# EAGLE design NumPad (EAGLE 6.3)
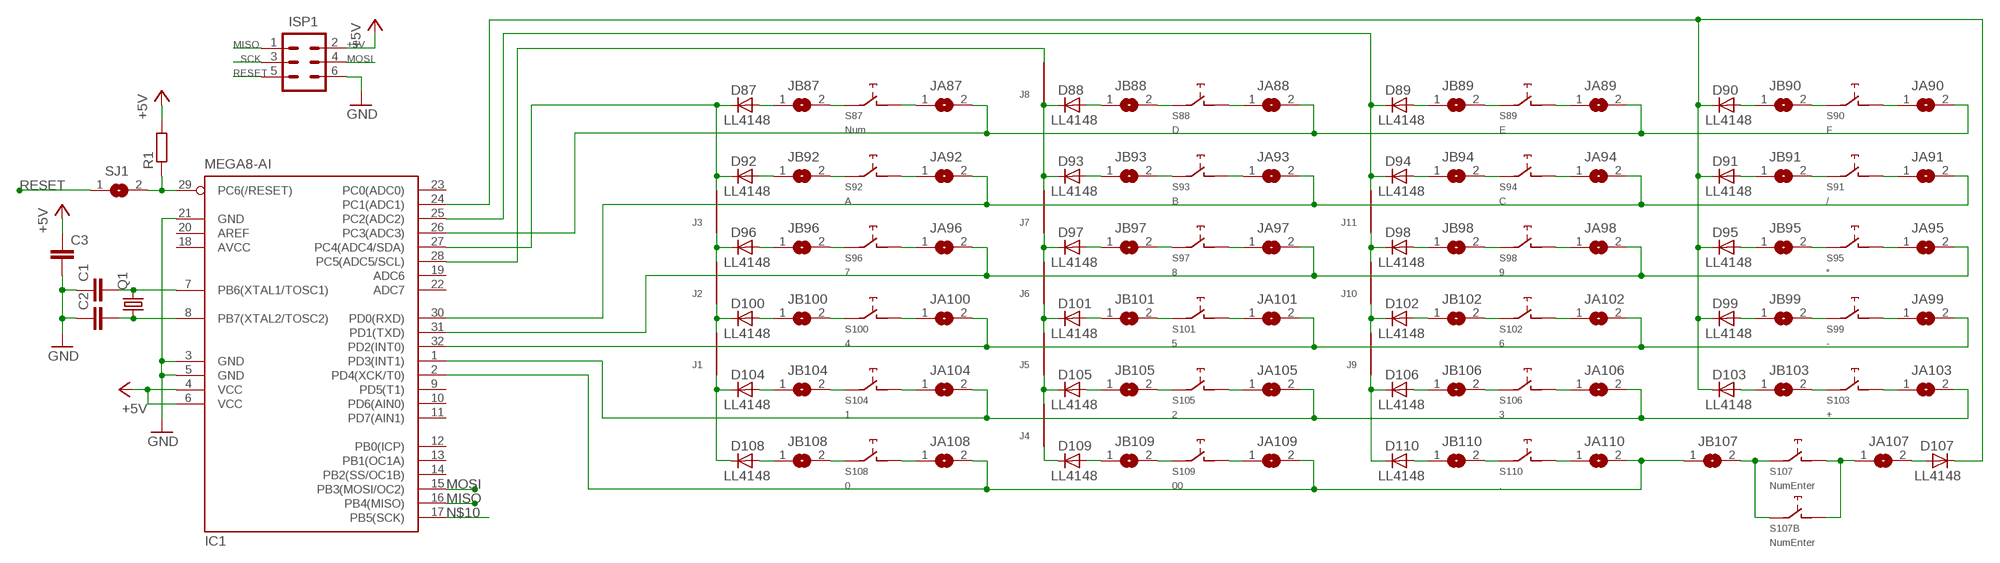
[diagram p0: schematic, sheet 1]

## Parts
C1  C-EUC0805  [C0805]
C2  C-EUC0805  [C0805]
C3  C-EUC0805  [C0805]
D87  LL4148  [SOD80C]
D88  LL4148  [SOD80C]
D89  LL4148  [SOD80C]
D90  LL4148  [SOD80C]
D91  LL4148  [SOD80C]
D92  LL4148  [SOD80C]
D93  LL4148  [SOD80C]
D94  LL4148  [SOD80C]
D95  LL4148  [SOD80C]
D96  LL4148  [SOD80C]
D97  LL4148  [SOD80C]
D98  LL4148  [SOD80C]
D99  LL4148  [SOD80C]
D100  LL4148  [SOD80C]
D101  LL4148  [SOD80C]
D102  LL4148  [SOD80C]
D103  LL4148  [SOD80C]
D104  LL4148  [SOD80C]
D105  LL4148  [SOD80C]
D106  LL4148  [SOD80C]
D107  LL4148  [SOD80C]
D108  LL4148  [SOD80C]
D109  LL4148  [SOD80C]
D110  LL4148  [SOD80C]
IC1  MEGA8-AI  [TQFP32-08]
ISP1  MA03-2  [MA03-2]
J1  J  [R1206W]
J2  J  [R1206W]
J3  J  [R1206W]
J4  J  [R1206W]
J5  J  [R1206W]
J6  J  [R1206W]
J7  J  [R1206W]
J8  J  [R1206W]
J9  J  [R1206W]
J10  J  [R1206W]
J11  J  [R1206W]
JA87  SJ  [SJ]
JA88  SJ  [SJ]
JA89  SJ  [SJ]
JA90  SJ  [SJ]
JA91  SJ  [SJ]
JA92  SJ  [SJ]
JA93  SJ  [SJ]
JA94  SJ  [SJ]
JA95  SJ  [SJ]
JA96  SJ  [SJ]
JA97  SJ  [SJ]
JA98  SJ  [SJ]
JA99  SJ  [SJ]
JA100  SJ  [SJ]
JA101  SJ  [SJ]
JA102  SJ  [SJ]
JA103  SJ  [SJ]
JA104  SJ  [SJ]
JA105  SJ  [SJ]
JA106  SJ  [SJ]
JA107  SJ  [SJ]
JA108  SJ  [SJ]
JA109  SJ  [SJ]
JA110  SJ  [SJ]
JB87  SJ  [SJ]
JB88  SJ  [SJ]
JB89  SJ  [SJ]
JB90  SJ  [SJ]
JB91  SJ  [SJ]
JB92  SJ  [SJ]
JB93  SJ  [SJ]
JB94  SJ  [SJ]
JB95  SJ  [SJ]
JB96  SJ  [SJ]
JB97  SJ  [SJ]
JB98  SJ  [SJ]
JB99  SJ  [SJ]
JB100  SJ  [SJ]
JB101  SJ  [SJ]
JB102  SJ  [SJ]
JB103  SJ  [SJ]
JB104  SJ  [SJ]
JB105  SJ  [SJ]
JB106  SJ  [SJ]
JB107  SJ  [SJ]
JB108  SJ  [SJ]
JB109  SJ  [SJ]
JB110  SJ  [SJ]
Q1  CRYSTALHC49S  [HC49/S]
R1  R-EU_R0805  [R0805]
S87  Num  CHERRY-MX-4P  [CHERRY-MX-4P]
S88  D  CHERRY-MX-4P  [CHERRY-MX-4P]
S89  E  CHERRY-MX-4P  [CHERRY-MX-4P]
S90  F  CHERRY-MX-4P  [CHERRY-MX-4P]
S91  /  CHERRY-MX-4P  [CHERRY-MX-4P]
S92  A  CHERRY-MX-4P  [CHERRY-MX-4P]
S93  B  CHERRY-MX-4P  [CHERRY-MX-4P]
S94  C  CHERRY-MX-4P  [CHERRY-MX-4P]
S95  *  CHERRY-MX-4P  [CHERRY-MX-4P]
S96  7  CHERRY-MX-4P  [CHERRY-MX-4P]
S97  8  CHERRY-MX-4P  [CHERRY-MX-4P]
S98  9  CHERRY-MX-4P  [CHERRY-MX-4P]
S99  -  CHERRY-MX-4P  [CHERRY-MX-4P]
S100  4  CHERRY-MX-4P  [CHERRY-MX-4P]
S101  5  CHERRY-MX-4P  [CHERRY-MX-4P]
S102  6  CHERRY-MX-4P  [CHERRY-MX-4P]
S103  +  CHERRY-MX-4P  [CHERRY-MX-4P]
S104  1  CHERRY-MX-4P  [CHERRY-MX-4P]
S105  2  CHERRY-MX-4P  [CHERRY-MX-4P]
S106  3  CHERRY-MX-4P  [CHERRY-MX-4P]
S107  NumEnter  CHERRY-MX-4P  [CHERRY-MX-4P]
S107B  NumEnter  CHERRY-MX  [CHERRY-MX]
S108  0  CHERRY-MX-4P  [CHERRY-MX-4P]
S109  00  CHERRY-MX-4P  [CHERRY-MX-4P]
S110  .  CHERRY-MX-4P  [CHERRY-MX-4P]
SJ1  SJ  [SJ]

## Nets
+5V: C3.1 IC1.4(VCC) IC1.6(VCC) ISP1.2 R1.2
GND: C1.1 C2.1 C3.2 IC1.3(GND) IC1.5(GND) IC1.21(GND) ISP1.6
MISO: IC1.16(PB4(MISO)) ISP1.1
MOSI: IC1.15(PB3(MOSI/OC2)) ISP1.4
N$1: IC1.2(PD4(XCK/T0)) JA108.2 JA109.2 JA110.2 JB107.1
N$2: D107.A JA107.2
N$3: IC1.1(PD3(INT1)) JA103.2 JA104.2 JA105.2 JA106.2
N$4: IC1.32(PD2(INT0)) JA99.2 JA100.2 JA101.2 JA102.2
N$5: IC1.31(PD1(TXD)) JA95.2 JA96.2 JA97.2 JA98.2
N$6: IC1.30(PD0(RXD)) JA91.2 JA92.2 JA93.2 JA94.2
N$7: IC1.26(PC3(ADC3)) JA87.2 JA88.2 JA89.2 JA90.2
N$8: D100.C J1.1 J2.2
N$9: IC1.29(PC6(/RESET)) R1.1 SJ1.2
N$10: IC1.17(PB5(SCK))
N$12: D104.C D108.C J1.2
N$13: D87.C D92.C IC1.27(PC4(ADC4/SDA)) J3.1
N$14: IC1.28(PC5(ADC5/SCL)) J8.1
N$15: D96.C J2.1 J3.2
N$16: D89.C D94.C IC1.25(PC2(ADC2)) J11.1
N$17: D109.C J4.2
N$18: D105.C J4.1 J5.2
N$19: D101.C J5.1 J6.2
N$20: D97.C J6.1 J7.2
N$21: D88.C D93.C J7.1 J8.2
N$22: D102.C J9.1 J10.2
N$23: D106.C D110.C J9.2
N$24: D98.C J10.1 J11.2
N$51: JA107.1 S107.SW2(PIN-2) S107B.SW2(PIN-2)
N$60: D104.A JB104.1
N$268: D87.A JB87.1
N$269: D88.A JB88.1
N$270: JB87.2 S87.SW1(PIN-1)
N$271: JB88.2 S88.SW1(PIN-1)
N$272: JA87.1 S87.SW2(PIN-2)
N$273: JA88.1 S88.SW2(PIN-2)
N$274: D89.A JB89.1
N$275: JB89.2 S89.SW1(PIN-1)
N$276: JA89.1 S89.SW2(PIN-2)
N$277: D90.A JB90.1
N$278: JB90.2 S90.SW1(PIN-1)
N$279: JA90.1 S90.SW2(PIN-2)
N$280: D91.A JB91.1
N$281: JB91.2 S91.SW1(PIN-1)
N$282: JA91.1 S91.SW2(PIN-2)
N$283: JB92.2 S92.SW1(PIN-1)
N$284: D92.A JB92.1
N$285: JA92.1 S92.SW2(PIN-2)
N$286: JA93.1 S93.SW2(PIN-2)
N$287: JB93.2 S93.SW1(PIN-1)
N$288: D93.A JB93.1
N$289: D94.A JB94.1
N$290: JB94.2 S94.SW1(PIN-1)
N$291: JA94.1 S94.SW2(PIN-2)
N$292: D95.A JB95.1
N$293: JB95.2 S95.SW1(PIN-1)
N$294: JA95.1 S95.SW2(PIN-2)
N$295: D96.A JB96.1
N$296: JB96.2 S96.SW1(PIN-1)
N$297: JA96.1 S96.SW2(PIN-2)
N$298: JB97.2 S97.SW1(PIN-1)
N$299: JA97.1 S97.SW2(PIN-2)
N$300: D97.A JB97.1
N$301: D98.A JB98.1
N$302: JB98.2 S98.SW1(PIN-1)
N$303: JA98.1 S98.SW2(PIN-2)
N$304: D99.A JB99.1
N$305: JB99.2 S99.SW1(PIN-1)
N$306: JA99.1 S99.SW2(PIN-2)
N$307: D100.A JB100.1
N$308: JB100.2 S100.SW1(PIN-1)
N$309: JA100.1 S100.SW2(PIN-2)
N$310: JB101.2 S101.SW1(PIN-1)
N$311: D101.A JB101.1
N$312: JA101.1 S101.SW2(PIN-2)
N$313: D102.A JB102.1
N$314: JB102.2 S102.SW1(PIN-1)
N$315: JA102.1 S102.SW2(PIN-2)
N$316: D103.A JB103.1
N$317: JB103.2 S103.SW1(PIN-1)
N$318: JA103.1 S103.SW2(PIN-2)
N$319: JB107.2 S107.SW1(PIN-1) S107B.SW1(PIN-1)
N$320: JB104.2 S104.SW1(PIN-1)
N$321: JA104.1 S104.SW2(PIN-2)
N$322: JB105.2 S105.SW1(PIN-1)
N$323: D105.A JB105.1
N$324: JA105.1 S105.SW2(PIN-2)
N$325: D106.A JB106.1
N$326: JB106.2 S106.SW1(PIN-1)
N$327: JA106.1 S106.SW2(PIN-2)
N$329: JB108.2 S108.SW1(PIN-1)
N$330: JA108.1 S108.SW2(PIN-2)
N$331: D108.A JB108.1
N$332: JB109.2 S109.SW1(PIN-1)
N$333: D109.A JB109.1
N$334: JA109.1 S109.SW2(PIN-2)
N$335: D110.A JB110.1
N$336: JB110.2 S110.SW1(PIN-1)
N$337: JA110.1 S110.SW2(PIN-2)
N$338: C1.2 IC1.7(PB6(XTAL1/TOSC1)) Q1.2
N$339: C2.2 IC1.8(PB7(XTAL2/TOSC2)) Q1.1
RESET: ISP1.5 SJ1.1
SCK: D90.C D91.C D95.C D99.C D103.C D107.C IC1.24(PC1(ADC1)) ISP1.3
Unconnected: IC1.9(PD5(T1)) IC1.10(PD6(AIN0)) IC1.11(PD7(AIN1)) IC1.12(PB0(ICP)) IC1.13(PB1(OC1A)) IC1.14(PB2(SS/OC1B)) IC1.19(ADC6) IC1.20(AREF) IC1.22(ADC7) IC1.23(PC0(ADC0)) S87.D1(_D:D1) S87.D2(_D:D2) S87.LED1(_L:LED1) S87.LED2(_L:LED2) S88.D1(_D:D1) S88.D2(_D:D2) S88.LED1(_L:LED1) S88.LED2(_L:LED2) S89.D1(_D:D1) S89.D2(_D:D2) S89.LED1(_L:LED1) S89.LED2(_L:LED2) S90.D1(_D:D1) S90.D2(_D:D2) S90.LED1(_L:LED1) S90.LED2(_L:LED2) S91.D1(_D:D1) S91.D2(_D:D2) S91.LED1(_L:LED1) S91.LED2(_L:LED2) S92.D1(_D:D1) S92.D2(_D:D2) S92.LED1(_L:LED1) S92.LED2(_L:LED2) S93.D1(_D:D1) S93.D2(_D:D2) S93.LED1(_L:LED1) S93.LED2(_L:LED2) S94.D1(_D:D1) S94.D2(_D:D2) S94.LED1(_L:LED1) S94.LED2(_L:LED2) S95.D1(_D:D1) S95.D2(_D:D2) S95.LED1(_L:LED1) S95.LED2(_L:LED2) S96.D1(_D:D1) S96.D2(_D:D2) S96.LED1(_L:LED1) S96.LED2(_L:LED2) S97.D1(_D:D1) S97.D2(_D:D2) S97.LED1(_L:LED1) S97.LED2(_L:LED2) S98.D1(_D:D1) S98.D2(_D:D2) S98.LED1(_L:LED1) S98.LED2(_L:LED2) S99.D1(_D:D1) S99.D2(_D:D2) S99.LED1(_L:LED1) S99.LED2(_L:LED2) S100.D1(_D:D1) S100.D2(_D:D2) S100.LED1(_L:LED1) S100.LED2(_L:LED2) S101.D1(_D:D1) S101.D2(_D:D2) S101.LED1(_L:LED1) S101.LED2(_L:LED2) S102.D1(_D:D1) S102.D2(_D:D2) S102.LED1(_L:LED1) S102.LED2(_L:LED2) S103.D1(_D:D1) S103.D2(_D:D2) S103.LED1(_L:LED1) S103.LED2(_L:LED2) S104.D1(_D:D1) S104.D2(_D:D2) S104.LED1(_L:LED1) S104.LED2(_L:LED2) S105.D1(_D:D1) S105.D2(_D:D2) S105.LED1(_L:LED1) S105.LED2(_L:LED2) S106.D1(_D:D1) S106.D2(_D:D2) S106.LED1(_L:LED1) S106.LED2(_L:LED2) S107.D1(_D:D1) S107.D2(_D:D2) S107.LED1(_L:LED1) S107.LED2(_L:LED2) S108.D1(_D:D1) S108.D2(_D:D2) S108.LED1(_L:LED1) S108.LED2(_L:LED2) S109.D1(_D:D1) S109.D2(_D:D2) S109.LED1(_L:LED1) S109.LED2(_L:LED2) S110.D1(_D:D1) S110.D2(_D:D2) S110.LED1(_L:LED1) S110.LED2(_L:LED2)

## Power pins joined to a net without a drawn wire
AVCC: IC1.18(AVCC)

## Library data of the parts
C1-C3 = rcl:C-EU: CAPACITOR, European symbol
D87-D110 = detali:LL4148: DIODE high speed
IC1 = atmel:MEGA8: MICROCONTROLLER 8 Kbytes FLASH, 1 kbytes SRAM, 512 bytes EEPROM, USART, 6-channel 10 bit ADC, 2-channel 8 bit ADC Pin compatible with Atmega48, ATMega88, ATMega168 Source: avr.lbr; MPN: ATMEGA8-16AU; OC_FARNELL: 9171371; OC_NEWARK: 73M8863
ISP1 = con-lstb:MA03-2: PIN HEADER
J1-J11 = detali:J
JA87-JA110 JB87-JB110 SJ1 = detali:SJ: SMD solder JUMPER
Q1 = crystal:CRYSTAL: CRYSTAL; OC_FARNELL: 1667008; OC_NEWARK: unknown
R1 = rcl:R-EU_: RESISTOR, European symbol
S87-S110 = cherrymx:CHERRY-MX-4P
S107B = cherrymx:CHERRY-MX: Cherry MX series keyswitch

## Board
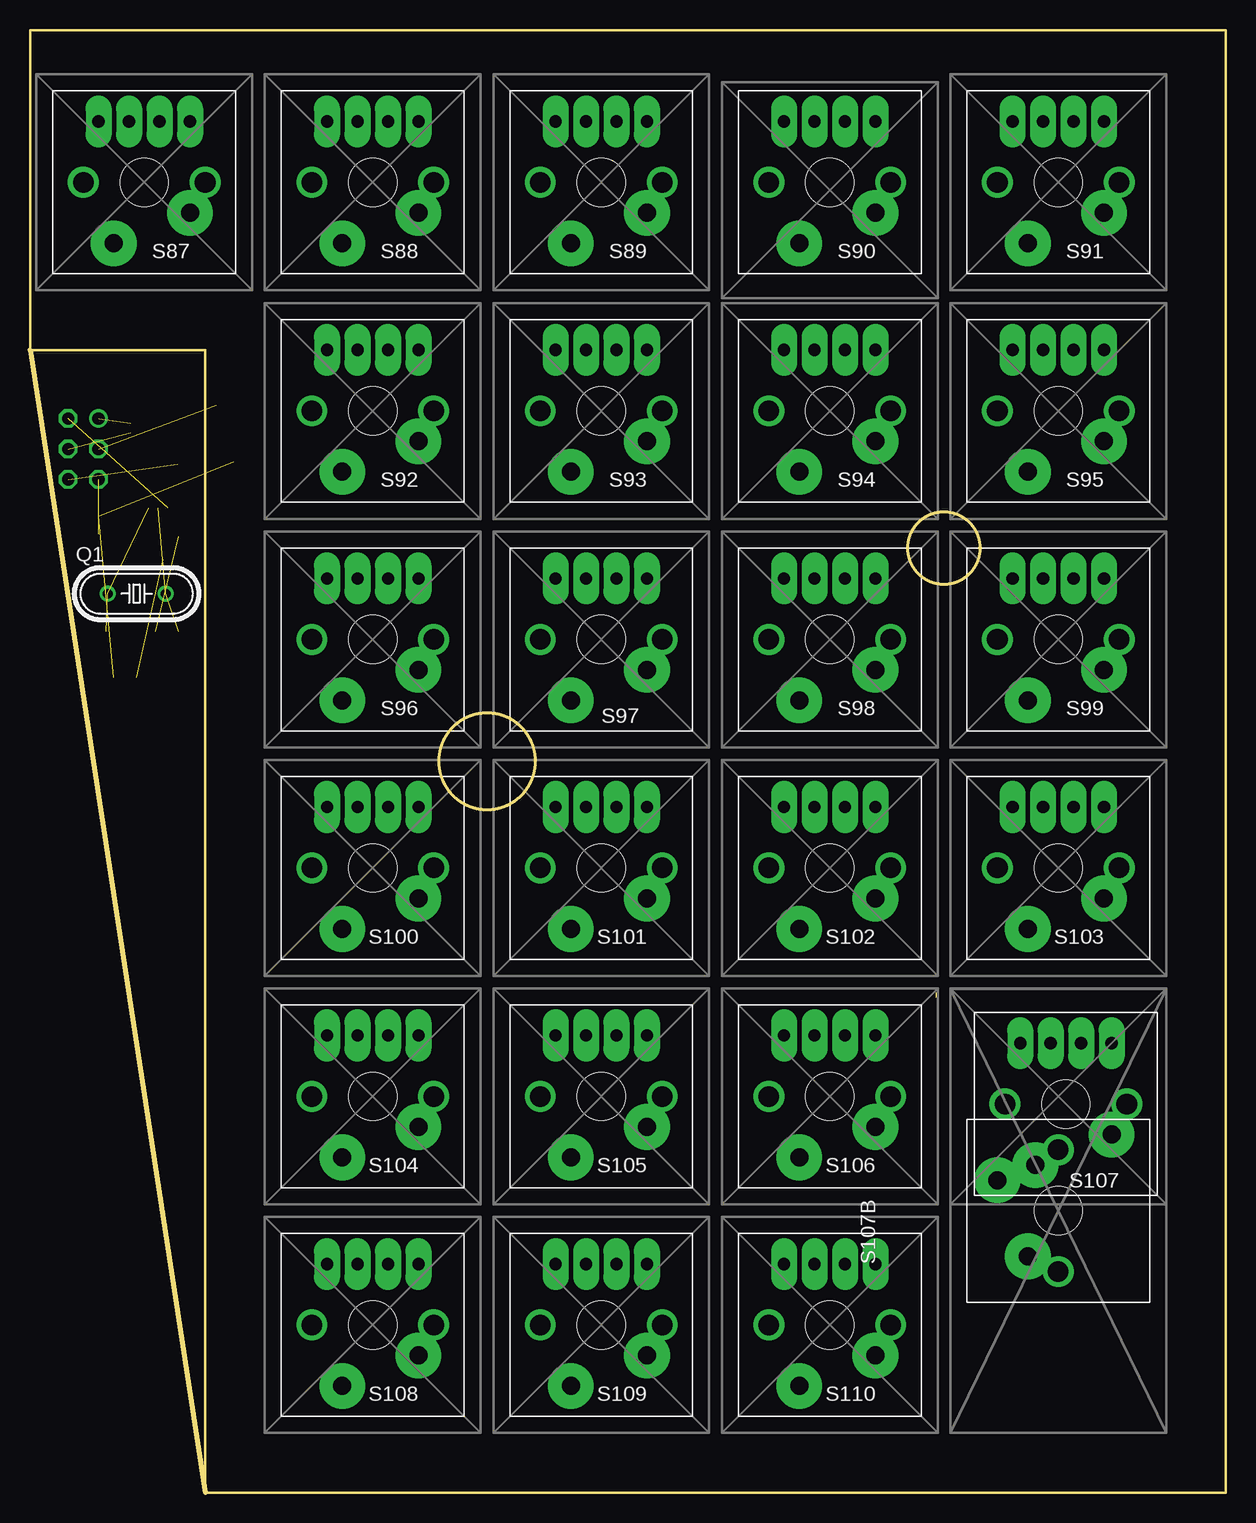
[diagram p1: board, top side]
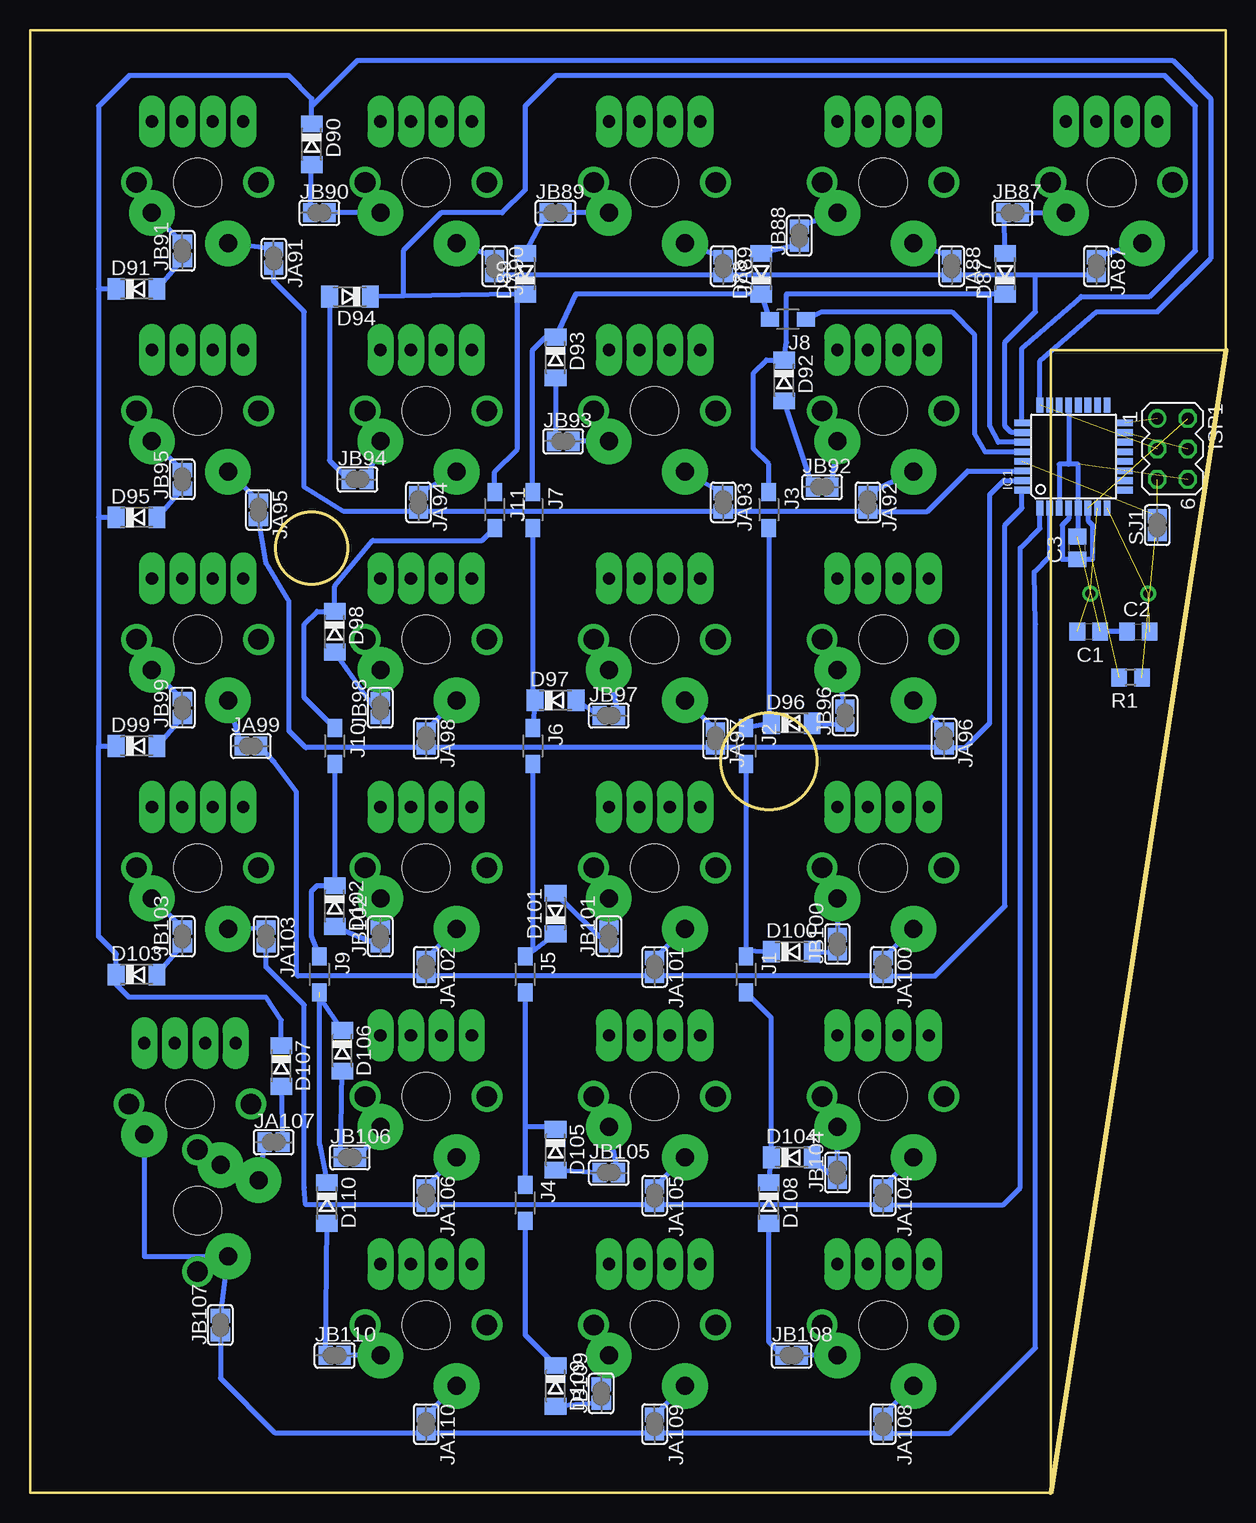
[diagram p2: board, bottom side, seen from below]

Size 99.69 x 121.92 mm. Coordinates in mm from the lower left corner, seen from the top.
Outline: 0,95.25 0,121.92 99.69,121.92 99.69,0 14.61,0
Outline: 0,95.25 14.61,95.25 14.61,0
Outline: 0,95.25 14.61,0
Outline: circle at 38.1,60.96 radius 4
Outline: circle at 76.2,78.74 radius 3
Copper layers (1*16): Top 0.035mm / dielectric 1.5mm / Bottom 0.035mm
Design rules "default": minimum track width 10mil, minimum drill 24mil, track to track 8mil, track to pad 8mil, pad to pad 8mil, via to via 8mil, smd to smd 8mil, copper to edge 40mil, drill to drill 8mil, minimum pad ring 10mil, minimum via ring 8mil, stop-mask expansion 4mil, vias tented up to drill 0mil, thermal gap 10mil

### Footprints (pad centres in the part's own frame; a part is rotated, then mirrored left to right if it is on the bottom)
C0805 = smd 1.3 x 1.5: 1 -0.95,0; 2 0.95,0
SOD80C = smd 1.4 x 1.8 bottom: A -1.7,0; C 1.7,0
TQFP32-08 = smd 1.27 x 0.559: 1 -4.293,2.8; 2 -4.293,2; 3 -4.293,1.2; 4 -4.293,0.4; 5 -4.293,-0.4; 6 -4.293,-1.2; 7 -4.293,-2; 8 -4.293,-2.8; 17 4.293,-2.8; 18 4.293,-2; 19 4.293,-1.2; 20 4.293,-0.4; 21 4.293,0.4; 22 4.293,1.2; 23 4.293,2; 24 4.293,2.8 | smd 0.559 x 1.27: 9 -2.8,-4.293; 10 -2,-4.293; 11 -1.2,-4.293; 12 -0.4,-4.293; 13 0.4,-4.293; 14 1.2,-4.293; 15 2,-4.293; 16 2.8,-4.293; 25 2.8,4.293; 26 2,4.293; 27 1.2,4.293; 28 0.4,4.293; 29 -0.4,4.293; 30 -1.2,4.293; 31 -2,4.293; 32 -2.8,4.293
MA03-2 = drill 1.016: 1 -2.54,-1.27 | drill 1.016 octagon: 2 -2.54,1.27; 3 0,-1.27; 4 0,1.27; 5 2.54,-1.27; 6 2.54,1.27
R1206W = smd 1.5 x 1.2: 1 -1.499,0; 2 1.499,0
SJ = smd 1.168 x 1.6 bottom: 1 0.762,0; 2 -0.762,0
HC49/S = drill 0.813: 1 -2.413,0; 2 2.413,0
R0805 = smd 1.3 x 1.5: 1 -0.95,0; 2 0.95,0
CHERRY-MX-4P = drill 1.016 pad 2.184 long: D1 -3.81,-5.08; D2 3.81,-5.08; LED1 -1.27,-5.08; LED2 1.27,-5.08 | drill 1.714 pad 1.93: P$3 -5.08,0; P$4 5.08,0 | drill 1.5 pad 3.81: SW1 -3.81,2.54; SW2 2.54,5.08 | hole 4: 0,0
CHERRY-MX = drill 0.8: P$1 0,0 | drill 1.714 pad 1.93: P$3 -5.08,0; P$4 5.08,0 | drill 1.5 pad 3.81: SW1 -3.81,2.54; SW2 2.54,5.08 | hole 4: 0,0

### Placement (x,y rotation side)
C1  11.43,71.75 180 bottom
C2  7.3,71.75 0 bottom
C3  12.38,78.74 90 bottom
D87  18.41,101.6 270 top
D88  38.73,101.6 270 top
D89  58.42,101.6 270 top
D90  76.2,112.39 90 top
D91  90.81,100.33 0 top
D92  36.83,92.71 90 top
D93  55.88,94.61 90 top
D94  73.03,99.69 180 top
D95  90.81,81.28 0 top
D96  36.2,64.14 0 top
D97  55.88,66.04 0 top
D98  74.3,71.75 90 top
D99  90.81,62.23 0 top
D100  36.2,45.09 0 top
D101  55.88,48.26 270 top
D102  74.3,48.89 90 top
D103  90.81,43.18 0 top
D104  36.2,27.94 0 top
D105  55.88,28.58 90 top
D106  73.66,36.83 90 top
D107  78.74,35.56 90 top
D108  38.1,24.13 90 top
D109  55.88,8.89 90 top
D110  74.93,24.13 90 top
IC1  12.7,86.36 90 bottom
ISP1  4.44,87 270 bottom
J1  40,43.18 270 bottom
J2  40,62.23 270 bottom
J3  38.1,81.92 270 bottom
J4  58.42,24.13 270 bottom
J5  58.42,43.18 270 bottom
J6  57.78,62.23 270 bottom
J7  57.78,81.92 270 bottom
J8  36.51,97.79 180 bottom
J9  75.56,43.18 270 bottom
J10  74.3,62.23 270 bottom
J11  60.96,81.92 270 bottom
JA87  10.79,102.23 90 top
JA88  22.86,102.23 90 top
JA89  41.91,102.23 90 top
JA90  60.96,102.23 90 top
JA91  79.38,102.87 90 top
JA92  29.84,82.55 90 top
JA93  41.91,82.55 90 top
JA94  67.31,82.55 90 top
JA95  80.65,81.92 90 top
JA96  23.49,62.86 90 top
JA97  42.55,62.86 90 top
JA98  66.67,62.86 90 top
JA99  81.28,62.23 0 top
JA100  28.57,43.81 90 top
JA101  47.62,43.81 90 top
JA102  66.67,43.81 90 top
JA103  80.01,46.35 90 top
JA104  28.57,24.77 90 top
JA105  47.62,24.77 90 top
JA106  66.67,24.77 90 top
JA107  79.38,29.21 0 top
JA108  28.57,5.71 90 top
JA109  47.62,5.71 90 top
JA110  66.67,5.71 90 top
JB87  17.78,106.68 0 top
JB88  35.56,104.78 270 top
JB89  55.88,106.68 0 top
JB90  75.56,106.68 0 top
JB91  87,103.5 270 top
JB92  33.66,83.82 0 top
JB93  55.24,87.63 0 top
JB94  72.39,84.45 0 top
JB95  87,84.45 270 top
JB96  31.75,64.77 270 top
JB97  51.44,64.77 0 top
JB98  70.48,65.41 270 top
JB99  87,65.41 270 top
JB100  32.38,45.72 270 top
JB101  51.44,46.35 270 top
JB102  70.48,46.35 270 top
JB103  87,46.35 270 top
JB104  32.38,26.67 270 top
JB105  51.44,26.67 0 top
JB106  73.03,27.94 0 top
JB107  83.82,13.97 270 top
JB108  36.2,11.43 0 top
JB109  52.07,8.25 270 top
JB110  74.3,11.43 0 top
Q1  8.89,74.93 0 top
R1  7.94,67.94 180 bottom
S87  9.53,109.22 180 top
S88  28.57,109.22 180 top
S89  47.62,109.22 180 top
S90  66.67,109.22 180 top
S91  85.72,109.22 180 top
S92  28.57,90.17 180 top
S93  47.62,90.17 180 top
S94  66.67,90.17 180 top
S95  85.72,90.17 180 top
S96  28.57,71.12 180 top
S97  47.62,71.12 180 top
S98  66.67,71.12 180 top
S99  85.72,71.12 180 top
S100  28.57,52.07 180 top
S101  47.62,52.07 180 top
S102  66.67,52.07 180 top
S103  85.72,52.07 180 top
S104  28.57,33.02 180 top
S105  47.62,33.02 180 top
S106  66.67,33.02 180 top
S107  86.36,32.38 180 top
S107B  85.72,23.49 90 top
S108  28.57,13.97 180 top
S109  47.62,13.97 180 top
S110  66.67,13.97 180 top
SJ1  5.71,80.64 270 top
U$87  [18X18]  8.25,110.49 0 top
U$88  [18X18]  27.3,110.49 0 top
U$89  [18X18]  46.35,110.49 0 top
U$90  [18X18]  65.41,109.86 0 top
U$91  [18X18]  84.46,110.49 0 top
U$92  [18X18]  84.46,91.44 0 top
U$93  [18X18]  65.41,91.44 0 top
U$94  [18X18]  46.35,91.44 0 top
U$95  [18X18]  27.3,91.44 0 top
U$96  [18X18]  27.3,72.39 0 top
U$97  [18X18]  46.35,72.39 0 top
U$98  [18X18]  65.41,72.39 0 top
U$99  [18X18]  84.46,72.39 0 top
U$100  [18X18]  27.3,53.34 0 top
U$101  [18X18]  46.35,53.34 0 top
U$102  [18X18]  65.41,53.34 0 top
U$103  [18X18]  84.46,53.34 0 top
U$104  [18X18]  27.3,34.29 0 top
U$105  [18X18]  46.35,34.29 0 top
U$106  [18X18]  65.41,34.29 0 top
U$107  [18X18]  84.46,34.29 0 top
U$108  [18X18]  27.3,15.24 0 top
U$109  [18X18]  46.35,15.24 0 top
U$110  [18X18]  65.41,15.24 0 top
U$111  [37X18]  85.72,23.49 0 top

### Tracks (layer width: path | path; a pad name or v marks a point on that pad's centre or on a via)
+5V  (2 unrouted)
  Bottom 0.406: IC1.4 13.1,81.2 13.65,80.64 13.65,77.79 C3.1 | IC1.6 11.5,81.03 11.11,80.64 11.11,77.79 C3.1 | C3.1
GND  (2 unrouted)
  Bottom 0.406: IC1.21 13.1,85.72 | IC1.3 13.9,85.72 13.1,85.72 | 13.1,85.72 12.3,85.72 IC1.5 C3.2 | C2.1 C1.1
MISO  (1 unrouted)
MOSI  (1 unrouted)
N$1
  Bottom 0.406: JB107.1 83.82,9.52 79.25,4.95 JA110.2 JA109.2 JA108.2 22.99,4.95 15.88,12.06 15.88,72.39 15.97,76.74 14.7,78.01 IC1.2
N$2
  Bottom 0.406: D107.A JA107.2
N$3
  Bottom 0.406: JA103.2 80.01,43.81 76.84,40.64 76.84,25.4 76.71,24 JA106.2 JA105.2 JA104.2 18.54,24 17.14,25.4 17.14,78.74 15.5,80.39 IC1.1
N$4
  Bottom 0.406: JA99.2 79.38,60.96 77.47,58.42 77.47,43.18 77.34,43.05 JA102.2 JA101.2 JA100.2 24.26,43.05 18.41,48.89 18.41,80.64 16.99,82.07 IC1.32
N$5
  Bottom 0.406: JA95.2 80.01,77.47 78.1,74.3 78.1,63.5 76.71,62.1 JA98.2 JA97.2 JA96.2 21.72,62.1 19.69,64.14 19.69,83.19 18.51,84.36 IC1.31
N$6
  Bottom 0.406: JA91.2 79.38,100.97 76.84,98.42 76.84,83.82 73.53,81.79 JA94.2 JA93.2 JA92.2 24.89,81.79 21.52,85.16 IC1.30
N$7
  Bottom 0.406: 15.88,101.47 JA87.2 10.72,101.4 | 15.88,101.47 JA88.2 JA89.2 JA90.2 | IC1.26 17.88,88.36 18.41,88.9 18.41,95.89 15.88,98.42 15.88,101.47
N$8
  Bottom 0.406: J2.2 40,45.29 39.9,45.19 | 39.9,45.19 D100.C | J1.1 39.9,45.19
N$9  (2 unrouted)
N$12
  Bottom 0.406: D108.C D104.C 37.89,39.57 J1.2
N$13
  Bottom 0.406: D87.C 19.69,99.9 | 19.69,99.9 36.62,99.9 36.62,95.89 D92.C 38.3,94.41 39.37,93.34 39.37,87 38.1,85.72 J3.1 | IC1.27 18.98,87.56 19.69,88.9 19.69,99.9
N$14
  Bottom 0.406: J8.1 33.66,98.42 22.86,98.42 20.95,96.52 20.95,88.27 20.09,86.76 IC1.28
N$15
  Bottom 0.406: J2.1 D96.C 38.1,64.34 J3.2
N$16
  Bottom 0.406: D89.C 59.06,99.89 | 59.06,99.89 68.57,99.74 | 68.57,99.74 D94.C | J11.1 60.96,85.09 59.05,87 59.05,99.89 59.06,99.89 | 68.57,99.74 68.58,99.75 68.58,103.5 65.41,106.68 60.33,106.68 58.42,108.58 58.42,115.57 55.88,118.11 5.08,118.11 2.54,115.57 2.54,103.5 6.35,99.69 12.06,99.69 16.99,95.4 IC1.25
N$17
  Bottom 0.406: J4.2 58.42,13.13 D109.C
N$18
  Bottom 0.406: J5.2 58.42,30.48 | 58.42,30.48 J4.1 | D105.C 56.09,30.48 58.42,30.48
N$19
  Bottom 0.406: D101.C 57.82,45.13 | 57.82,45.13 J5.1 | J6.2 57.78,45.16 57.82,45.13
N$20
  Bottom 0.406: J6.1 D97.C 57.78,66.25 J7.2
N$21
  Bottom 0.406: J7.1 57.78,95.25 56.72,96.31 D93.C 54.2,99.9 D88.C J8.2
N$22
  Bottom 0.406: J9.1 76.2,46.35 76.2,50.16 75.77,50.59 D102.C J10.2
N$23  (1 unrouted)
  Bottom 0.406: D106.C 75.56,41.27 75.56,29.01 D110.C
N$24
  Bottom 0.406: J10.1 76.84,66.27 76.84,72.39 75.77,73.45 D98.C 74.3,75.56 71.12,79.38 62,79.38 J11.2
N$51
  Bottom 0.406: JA107.1 S107B.SW2 S107.SW2
N$60
  Bottom 0.406: JB104.1 D104.A
N$268
  Bottom 0.406: JB87.1 D87.A
N$269
  Bottom 0.406: JB88.1 D88.A
N$270
  Bottom 0.406: JB87.2 S87.SW1
N$271
  Bottom 0.406: S88.SW1 JB88.2
N$272
  Bottom 0.406: S87.SW2 JA87.1
N$273
  Bottom 0.406: JA88.1 S88.SW2
N$274
  Bottom 0.406: JB89.1 D89.A
N$275
  Bottom 0.406: S89.SW1 JB89.2
N$276
  Bottom 0.406: S89.SW2 JA89.1
N$277
  Bottom 0.406: JB90.1 D90.A
N$278
  Bottom 0.406: S90.SW1 JB90.2
N$279
  Bottom 0.406: JA90.1 S90.SW2
N$280
  Bottom 0.406: D91.A JB91.1
N$281
  Bottom 0.406: S91.SW1 JB91.2
N$282
  Bottom 0.406: JA91.1 S91.SW2
N$283
  Bottom 0.406: JB92.2 S92.SW1
N$284
  Bottom 0.406: JB92.1 D92.A
N$285
  Bottom 0.406: JA92.1 S92.SW2
N$286
  Bottom 0.406: S93.SW2 JA93.1
N$287
  Bottom 0.406: S93.SW1 JB93.2
N$288
  Bottom 0.406: D93.A 55.88,87.76 JB93.1
N$289
  Bottom 0.406: D94.A 74.72,86.03 JB94.1
N$290
  Bottom 0.406: S94.SW1 JB94.2
N$291
  Bottom 0.406: JA94.1 S94.SW2
N$292
  Bottom 0.406: JB95.1 D95.A
N$293
  Bottom 0.406: JB95.2 S95.SW1
N$294
  Bottom 0.406: S95.SW2 JA95.1
N$295
  Bottom 0.406: D96.A JB96.1
N$296
  Bottom 0.406: JB96.2 S96.SW1
N$297
  Bottom 0.406: JA96.1 S96.SW2
N$298
  Bottom 0.406: S97.SW1 JB97.2
N$299
  Bottom 0.406: JA97.1 S97.SW2
N$300
  Bottom 0.406: JB97.1 D97.A
N$301
  Bottom 0.406: D98.A JB98.1
N$302
  Bottom 0.406: JB98.2 S98.SW1
N$303
  Bottom 0.406: JA98.1 S98.SW2
N$304
  Bottom 0.406: JB99.1 D99.A
N$305
  Bottom 0.406: JB99.2 S99.SW1
N$306
  Bottom 0.406: JA99.1 S99.SW2
N$307
  Bottom 0.406: JB100.1 D100.A
N$308
  Bottom 0.406: S100.SW1 JB100.2
N$309
  Bottom 0.406: JA100.1 S100.SW2
N$310
  Bottom 0.406: JB101.2 S101.SW1
N$311
  Bottom 0.406: D101.A JB101.1
N$312
  Bottom 0.406: JA101.1 S101.SW2
N$313
  Bottom 0.406: D102.A JB102.1
N$314
  Bottom 0.406: JB102.2 S102.SW1
N$315
  Bottom 0.406: JA102.1 S102.SW2
N$316
  Bottom 0.406: D103.A JB103.1
N$317
  Bottom 0.406: JB103.2 S103.SW1
N$318
  Bottom 0.406: S103.SW2 JA103.1
N$319
  Bottom 0.406: S107.SW1 90.17,19.68 S107B.SW1 JB107.2
N$320
  Bottom 0.406: JB104.2 S104.SW1
N$321
  Bottom 0.406: JA104.1 S104.SW2
N$322
  Bottom 0.406: JB105.2 S105.SW1
N$323
  Bottom 0.406: JB105.1 D105.A
N$324
  Bottom 0.406: JA105.1 S105.SW2
N$325
  Bottom 0.406: JB106.1 D106.A
N$326
  Bottom 0.406: S106.SW1 JB106.2
N$327
  Bottom 0.406: S106.SW2 JA106.1
N$329
  Bottom 0.406: S108.SW1 JB108.2
N$330
  Bottom 0.406: JA108.1 S108.SW2
N$331
  Bottom 0.406: JB108.1 38.1,12.57 D108.A
N$332
  Bottom 0.406: S109.SW1 JB109.2
N$333
  Bottom 0.406: JB109.1 D109.A
N$334
  Bottom 0.406: JA109.1 S109.SW2
N$335
  Bottom 0.406: JB110.1 D110.A
N$336
  Bottom 0.406: S110.SW1 JB110.2
N$337
  Bottom 0.406: JA110.1 S110.SW2
N$338  (2 unrouted)
N$339  (2 unrouted)
RESET  (1 unrouted)
SCK  (1 unrouted)
  Bottom 0.406: 93.98,62.23 93.98,46.35 92.5,44.88 D103.C 92.5,42.34 91.44,41.27 80.01,41.27 78.74,39.37 D107.C | 93.98,62.23 D99.C | D95.C 93.98,81.28 | 93.98,81.28 93.98,62.23 | 93.98,100.33 93.98,81.28 | D91.C 93.98,100.33 | 93.98,100.33 93.98,115.57 91.44,118.11 78.1,118.11 76.2,116.2 D90.C 76.2,115.57 72.39,119.38 4.44,119.38 1.27,116.2 1.27,102.87 5.71,98.42 10.79,98.42 15.5,94.36 IC1.24
(copper drawn outside any net)
  shapes: Top area x2